# Altium schematic sheet radio_module.SchDoc
size A4; SheetNumber: 1; SheetTotal: 3
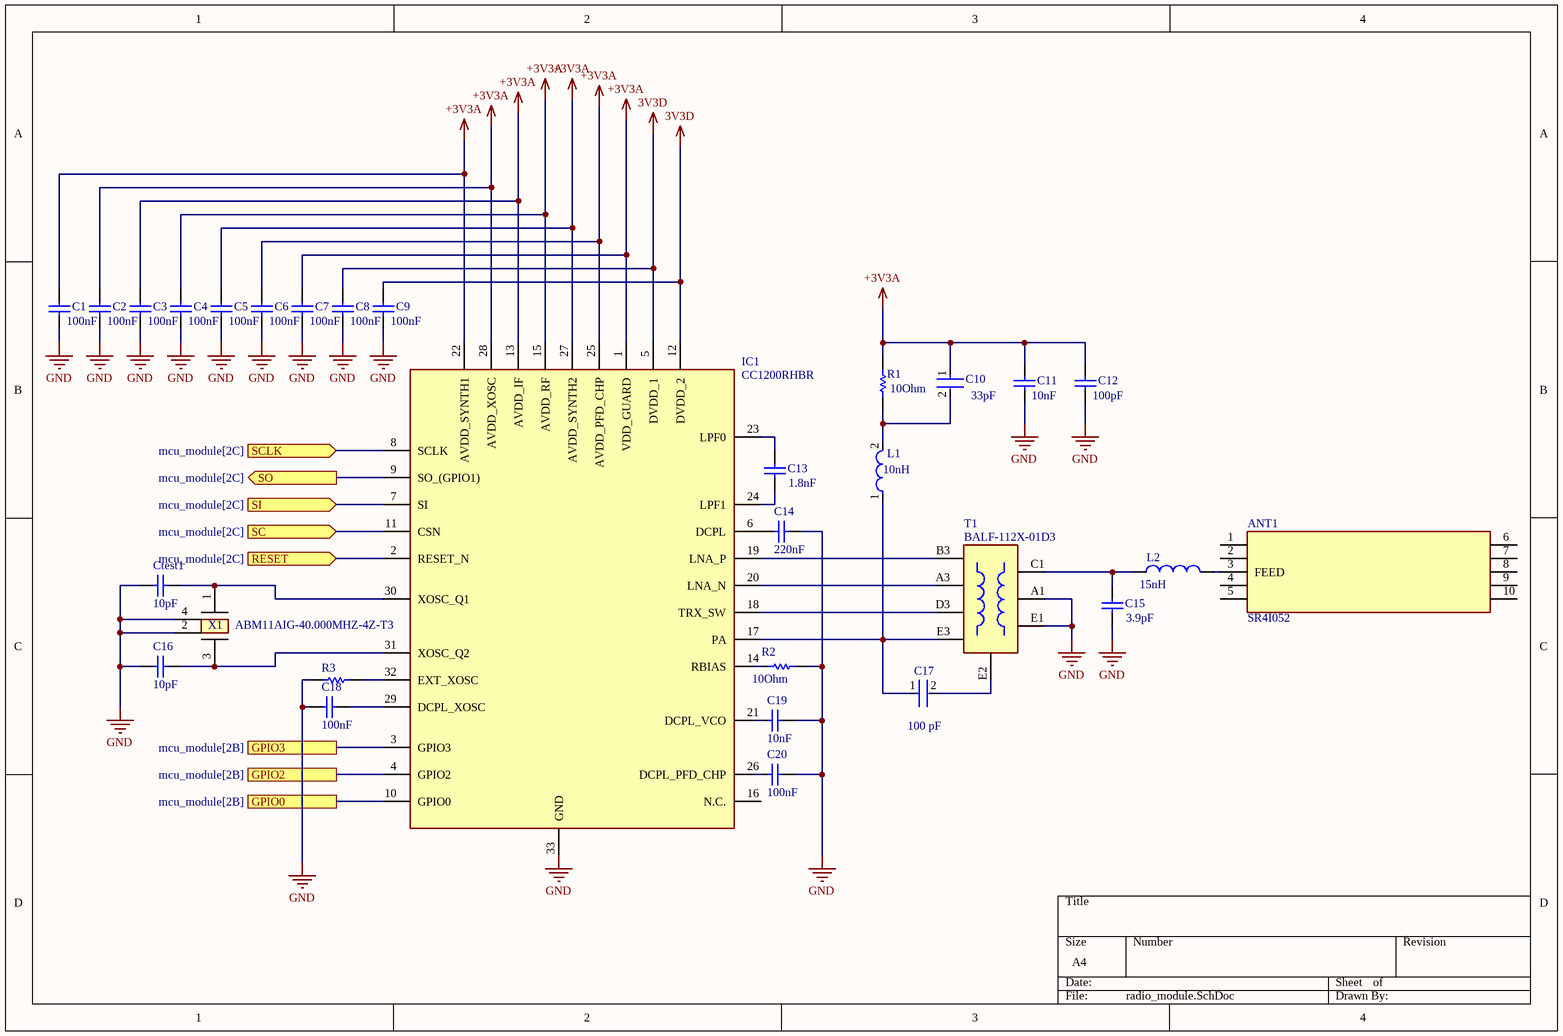
[diagram p0: radio_module.SchDoc]

## Parts
ANT1  SR4I052  [SR4I052]
C1  value 100nF  [CAPC1608X92X38LL15T08]  (hidden comment: VJ0603D3R9CXPAJ)
C2  value 100nF  [CAPC1608X92X38LL15T08]  (hidden comment: VJ0603D3R9CXPAJ)
C3  value 100nF  [CAPC1608X92X38LL15T08]  (hidden comment: VJ0603D3R9CXPAJ)
C4  value 100nF  [CAPC1608X92X38LL15T08]  (hidden comment: VJ0603D3R9CXPAJ)
C5  value 100nF  [CAPC1608X92X38LL15T08]  (hidden comment: VJ0603D3R9CXPAJ)
C6  value 100nF  [CAPC1608X92X38LL15T08]  (hidden comment: VJ0603D3R9CXPAJ)
C7  value 100nF  [CAPC1608X92X38LL15T08]  (hidden comment: VJ0603D3R9CXPAJ)
C8  value 100nF  [CAPC1608X92X38LL15T08]  (hidden comment: VJ0603D3R9CXPAJ)
C9  value 100nF  [CAPC1608X92X38LL15T08]  (hidden comment: VJ0603D3R9CXPAJ)
C10  value 33pF  [FP-C0402-BB-MFG]  (hidden comment: C0402C104K4RACTU)
C11  value 10nF  [CAPC1608X92X38LL15T08]  (hidden comment: VJ0603D3R9CXPAJ)
C12  value 100pF  [CAPC1608X92X38LL15T08]  (hidden comment: VJ0603D3R9CXPAJ)
C13  value 1.8nF  [CAPC1608X92X38LL15T08]  (hidden comment: VJ0603D3R9CXPAJ)
C14  value 220nF  [CAPC1608X92X38LL15T08]  (hidden comment: VJ0603D3R9CXPAJ)
C15  value 3.9pF  [CAPC1608X92X38LL15T08]  (hidden comment: VJ0603D3R9CXPAJ)
C16  value 10pF  [CAPC1608X92X38LL15T08]  (hidden comment: VJ0603D3R9CXPAJ)
C17  Capacitance: 100 pF  [FP-C0402-BB-MFG]  (hidden comment: C0402C101J5GACTU)
C18  value 100nF  [CAPC1608X92X38LL15T08]  (hidden comment: VJ0603D3R9CXPAJ)
C19  value 10nF  [CAPC1608X92X38LL15T08]  (hidden comment: VJ0603D3R9CXPAJ)
C20  value 100nF  [CAPC1608X92X38LL15T08]  (hidden comment: VJ0603D3R9CXPAJ)
Ctest1  value 10pF  [CAPC1608X92X38LL15T08]  (hidden comment: VJ0603D3R9CXPAJ)
IC1  CC1200RHBR  [QFN50P500X500X100-33N-D]
L1  Inductance: 10nH  [FP-LQW15AN_00-W0_6-0_1-MFG]  (hidden comment: LQW15AN10NH00D)
L2  Inductance: 15nH  [WE-MK_0603_L1.6W0.8H0.8]  (hidden comment: 7447860115G)
R1  value 10Ohm  [RESC1005X40X25NL05T05]  (hidden comment: CRCW040210R0FKED)
R2  Resistance: 10Ohm  [RESC1608X55X25ML10T15]  (hidden comment: RC0603JR-070RL)
R3  RC0603JR-070RL  [RESC1608X55X25ML10T15]  (value not drawn)
T1  BALF-112X-01D3  [BALF112X01D3]
X1  ABM11AIG-40.000MHZ-4Z-T3  [ABM11AIG16000MHZ81ZT]

## Ports
GPIO0 (see mcu_module[2B]), GPIO2 (see mcu_module[2B]), GPIO3 (see mcu_module[2B]), RESET (in, see mcu_module[2C]), SC (in, see mcu_module[2C]), SCLK (in, see mcu_module[2C]), SI (in, see mcu_module[2C]), SO (out, see mcu_module[2C])

## Nets
3V3D: C8.2 C9.2 IC1.5(DVDD_1) IC1.12(DVDD_2)
+3V3A: C1.2 C2.2 C3.2 C4.2 C5.2 C6.2 C7.2 C10.1 C11.2 C12.2 IC1.1(VDD_GUARD) IC1.13(AVDD_IF) IC1.15(AVDD_RF) IC1.22(AVDD_SYNTH1) IC1.25(AVDD_PFD_CHP) IC1.27(AVDD_SYNTH2) IC1.28(AVDD_XOSC) R1.2
GND: C1.1 C2.1 C3.1 C4.1 C5.1 C6.1 C7.1 C8.1 C9.1 C11.1 C12.1 C14.2 C15.1 C16.2 C18.2 C19.1 C20.1 Ctest1.2 IC1.33(GND) R2.2 R3.1 T1.A1(GND_1) T1.E1(GND_2) X1.2(GND_1) X1.4(GND_2)
GPIO0: IC1.10(GPIO0) ; port GPIO0
GPIO2: IC1.4(GPIO2) ; port GPIO2
GPIO3: IC1.3(GPIO3) ; port GPIO3
RESET: IC1.2(RESET_N) ; port RESET
SC: IC1.11(CSN) ; port SC
SCLK: IC1.8(SCLK) ; port SCLK
SI: IC1.7(SI) ; port SI
SO: IC1.9(SO_(GPIO1)) ; port SO
NetANT1_3: ANT1.3(FEED) L2.2
NetC10_2: C10.2 L1.2 R1.1
NetC13_1: C13.1 IC1.24(LPF1)
NetC13_2: C13.2 IC1.23(LPF0)
NetC14_1: C14.1 IC1.6(DCPL)
NetC15_2: C15.2 L2.1 T1.C1(ANT)
NetC16_1: C16.1 IC1.31(XOSC_Q2) X1.3(X2)
NetC17_1: C17.1 IC1.17(PA) L1.1 T1.E3(PA_OUT)
NetC17_2: C17.2 T1.E2(PA_C)
NetC18_1: C18.1 IC1.29(DCPL_XOSC)
NetC19_2: C19.2 IC1.21(DCPL_VCO)
NetC20_2: C20.2 IC1.26(DCPL_PFD_CHP)
NetCtest1_1: Ctest1.1 IC1.30(XOSC_Q1) X1.1(X1)
NetIC1_14: IC1.14(RBIAS) R2.1
NetIC1_18: IC1.18(TRX_SW) T1.D3(TRX_SWITCH)
NetIC1_19: IC1.19(LNA_P) T1.B3(LNA+)
NetIC1_20: IC1.20(LNA_N) T1.A3(LNA-)
NetIC1_32: IC1.32(EXT_XOSC) R3.2

Not connected (* = marked no-connect by the designer): ANT1 1(NOT_CONNECTED_1) 2(NOT_CONNECTED_2) 4(NOT_CONNECTED_3) 5(NOT_CONNECTED_4) 6(NOT_CONNECTED_5) 7(NOT_CONNECTED_6) 8(NOT_CONNECTED_7) 9(NOT_CONNECTED_8) 10(NOT_CONNECTED_9); IC1 16(N.C.)

## Library data of the parts
ANT1 = SR4I052: Antenna; Manufacturer_Name: Antenova; Datasheet Link: https://www.antenova.com/wp-content/uploads/2020/05/Velox-SR42I052-PS-1.2.pdf; Height: 1mm; Manufacturer_Part_Number: SR4I052; Mouser Part Number: 237-SR4I052; Mouser Price/Stock: https://www.mouser.co.uk/ProductDetail/Antenova/SR4I052?qs=y6ZabgHbY%252BxNy8xWjcf7JA%3D%3D; Arrow Part Number: SR4I052; Arrow Price/Stock: https://www.arrow.com/en/products/sr4i052/antenova
C1-C9 C11-C16 C18-C20 Ctest1 = CMP-2006-01519-1: Manufacturer: Vitramon; Part Number: VJ0603D3R9CXPAJ
C10 = CMP-2008-02108-2: CAP CER 0.1UF 16V X7R 0402; Manufacturer: Kemet; Tolerance: 0.1; Material: Ceramic; Temperature Coefficient: 15%; Voltage Rating: 16 V; Package: C0402-BB; Automotive: No; Ipc Land Pattern Name: CAPC10050X50; Device Class L3: Ceramic Capacitors; Capacitance: 33pF; Octopart: https://octopart.com/c0402c104k4ractu-kemet-94158; Temperature Characteristic: X7R; Mouser Description: Cap Ceramic 0.1uF 16V X7R 10% SMD 0402 125?C Paper T/R - Tape and Reel (Alt: C0402C104K4RAC TU); ComponentLink2Description: Datasheet; Temperature Range Low: -55°C; RoHS: TRUE; Device Class L1: Passive Components; Manufacturer Part Number: C0402C104K4RACTU; Temperature Range High: +125°C; Device Class L2: Capacitors; ComponentLink2URL: https://content.kemet.com/datasheets/KEM_C1002_X7R_SMD.pdf; Category: Cap; Height: 0.55mm; Temperature: -55°C to +125°C; Lead Free: Yes; Digikey Description: CAP CER 0.1UF 16V X7R 0402
C17 = CMP-2008-03284-2: CAP CER 100PF 50V C0G/NP0 0402; Manufacturer: Kemet; Tolerance: 0.05; Temperature Characteristic: C0G; Temperature Coefficient: 15%; Material: Ceramic; Digikey Description: CAP CER 100PF 50V C0G/NP0 0402; Lead Free: Yes; Device Class L3: Ceramic Capacitors; Mouser Description: Multilayer Ceramic Capacitors MLCC - SMD/SMT 50volts 100pF C0G 5%; Octopart: https://octopart.com/c0402c101j5gactu-kemet-132471; Temperature Range Low: -55°C; Value: 100 pF; Automotive: No; Height: 0.55mm; Category: Cap; ComponentLink2URL: https://content.kemet.com/datasheets/KEM_C1002_X7R_SMD.pdf; Manufacturer Part Number: C0402C101J5GACTU; RoHS: TRUE; Ipc Land Pattern Name: CAPC10050X50; Temperature Range High: +125°C; Device Class L2: Capacitors; Package: C0402-BB; ComponentLink2Description: Datasheet; Temperature: -55°C to +125°C; Voltage Rating: 50 V; Device Class L1: Passive Components
IC1 = CC1200RHBR: Integrated Circuit; Manufacturer_Name: Texas Instruments; Datasheet Link: http://www.ti.com/lit/gpn/cc1200; Height: 1mm; Manufacturer_Part_Number: CC1200RHBR; Mouser Part Number: 595-CC1200RHBR; Mouser Price/Stock: https://www.mouser.co.uk/ProductDetail/Texas-Instruments/CC1200RHBR?qs=R6c3TimDHSkfQr3ZZbsbuA%3D%3D; Arrow Part Number: CC1200RHBR; Arrow Price/Stock: https://www.arrow.com/en/products/cc1200rhbr/texas-instruments
L1 = CMP-06042-000413-1: Wire Wound RF Inductor 10nH ±3% 500mA 0.17Ω 0402 (1005); Q Factor: 25; Core Material: Non-Magnetic; Test Frequency: 100MHz; DC Resistance (DCR): 170mR; Self Resonant Frequency: 5.5GHz; Shielding: Unshielded; Current: 370mA; Case Code (Imperial): 0402; Package Quantity: 10000; Height: 0.5mm; Width: 0.02inch; Case Code (Metric): 1005; Tolerance: 3%; Min Operating Temperature: -55°C; Packaging: Tape and Reel; Length: 1mm; DC Current: 500mA; Current Rating: 500mA; Military Standard: Not; Max DC Current: 500mA; Case/Package: 0402; Lead Free: Lead Free; Radiation Hardening: No; Weight: 2.8E-05oz; Height - Seated (Max): 0.024inch; Depth: 0.7mm; Termination: SMD/SMT; Resistor Type: Wirewound; Max Operating Temperature: 125°C; Mount: Surface Mount
L2 = CMP-03913-120013800-1: 7447860115G Multilayer Inductor, 15Nh, 0.3A, 0603 Rohs Compliant: Yes; Current Rating: 550mA; Length: 1.6mm; NexarPartId: 120013800; Height: 800µm; RoHS: Compliant; Max Operating Temperature: 125°C; Ambient Temperature Range Low: -55°C; Width: 800µm; Ambient Temperature Range High: 105°C; Min Operating Temperature: -55°C
R1 = CMP-2002-08143-1: Manufacturer: Vishay Dale; Part Number: CRCW040210R0FKED
R2 = CMP-2100-03667-1: Chip Resistor, 0 Ohm, +/- 5%, 0.1 W, -55 to 155 degC, 0603 (1608 Metric), RoHS, Tape and Reel; Manufacturer: Yageo; Temperature Coefficient: 200ppm/degreesC; Voltage Rating: 50V; Power Rating: 100mW; Width: 0.8mm; Max Operating Temperature: 155degC; Tolerance: 5%; Package Reference: 0603; Height: 0.45mm; Depth: 0.8mm; Package Description: 2-Pin Surface Mount Device, Body 1.6 x 0.8 mm; Termination: SMD/SMT; Package Quantity: 5000; Case/Package: 0603; Case Code (Imperial): 0603; Radiation Hardening: No; Number of Pins: 2; Length: 1.6mm; Lead Free: LeadFree; Voltage Rating (DC): 50V; Military Standard: Not; Datasheet URL: http://www.yageo.com/NewPortal/yageodocoutput?fileName=/pdf/R-Chip/PYu-RC_Group_51_RoHS_L_5.pdf; Manufacturer URL: http://www.yageo.com/; Packaging: TapeandReel; Case Code (Metric): 1608; Min Operating Temperature: -55degC; Composition: ThickFilm; RoHSCompliant: true; Contact Plating: Tin; Datasheet Version: Rev. 5, 10/2016; REACH SVHC: NoSVHC
R3 = CMP-2100-03667-1: Chip Resistor, 0 Ohm, +/- 5%, 0.1 W, -55 to 155 degC, 0603 (1608 Metric), RoHS, Tape and Reel; Manufacturer: Yageo; Temperature Coefficient: 200ppm/degreesC; Voltage Rating: 50V; Power Rating: 100mW; Resistance: 0mOhm; Width: 0.8mm; Max Operating Temperature: 155degC; Tolerance: 5%; Package Reference: 0603; Height: 0.45mm; Depth: 0.8mm; Package Description: 2-Pin Surface Mount Device, Body 1.6 x 0.8 mm; Termination: SMD/SMT; Package Quantity: 5000; Case/Package: 0603; Case Code (Imperial): 0603; Radiation Hardening: No; Number of Pins: 2; Length: 1.6mm; Lead Free: LeadFree; Voltage Rating (DC): 50V; Military Standard: Not; Datasheet URL: http://www.yageo.com/NewPortal/yageodocoutput?fileName=/pdf/R-Chip/PYu-RC_Group_51_RoHS_L_5.pdf; Manufacturer URL: http://www.yageo.com/; Packaging: TapeandReel; Case Code (Metric): 1608; Min Operating Temperature: -55degC; Composition: ThickFilm; RoHSCompliant: true; Contact Plating: Tin; Datasheet Version: Rev. 5, 10/2016; REACH SVHC: NoSVHC
T1 = BALF-112X-01D3: Transformer; Manufacturer_Name: STMicroelectronics; Datasheet Link: https://www.st.com/resource/en/datasheet/balf-112x-01d3.pdf; Height: 0.63mm; Manufacturer_Part_Number: BALF-112X-01D3; Mouser Part Number: 511-BALF-112X-01D3; Mouser Price/Stock: https://www.mouser.co.uk/ProductDetail/STMicroelectronics/BALF-112X-01D3?qs=aVyJF2WnouQ%252B6Mc%2F%2Fo9itQ%3D%3D; Arrow Part Number: BALF-112X-01D3; Arrow Price/Stock: https://www.arrow.com/en/products/balf-112x-01d3/stmicroelectronics
X1 = ABM11AIG-40.000MHZ-4Z-T3: Crystal or Oscillator; Manufacturer_Name: ABRACON; Datasheet Link: https://abracon.com/AIGcrystals/ABM11AIG.pdf; Height: 0.55mm; Manufacturer_Part_Number: ABM11AIG-40.000MHZ-4Z-T3; Mouser Part Number: 815-M11AIG-40-4ZT3; Mouser Price/Stock: https://www.mouser.com/Search/Refine.aspx?Keyword=815-M11AIG-40-4ZT3